# Altium project Arm.PrjPcb
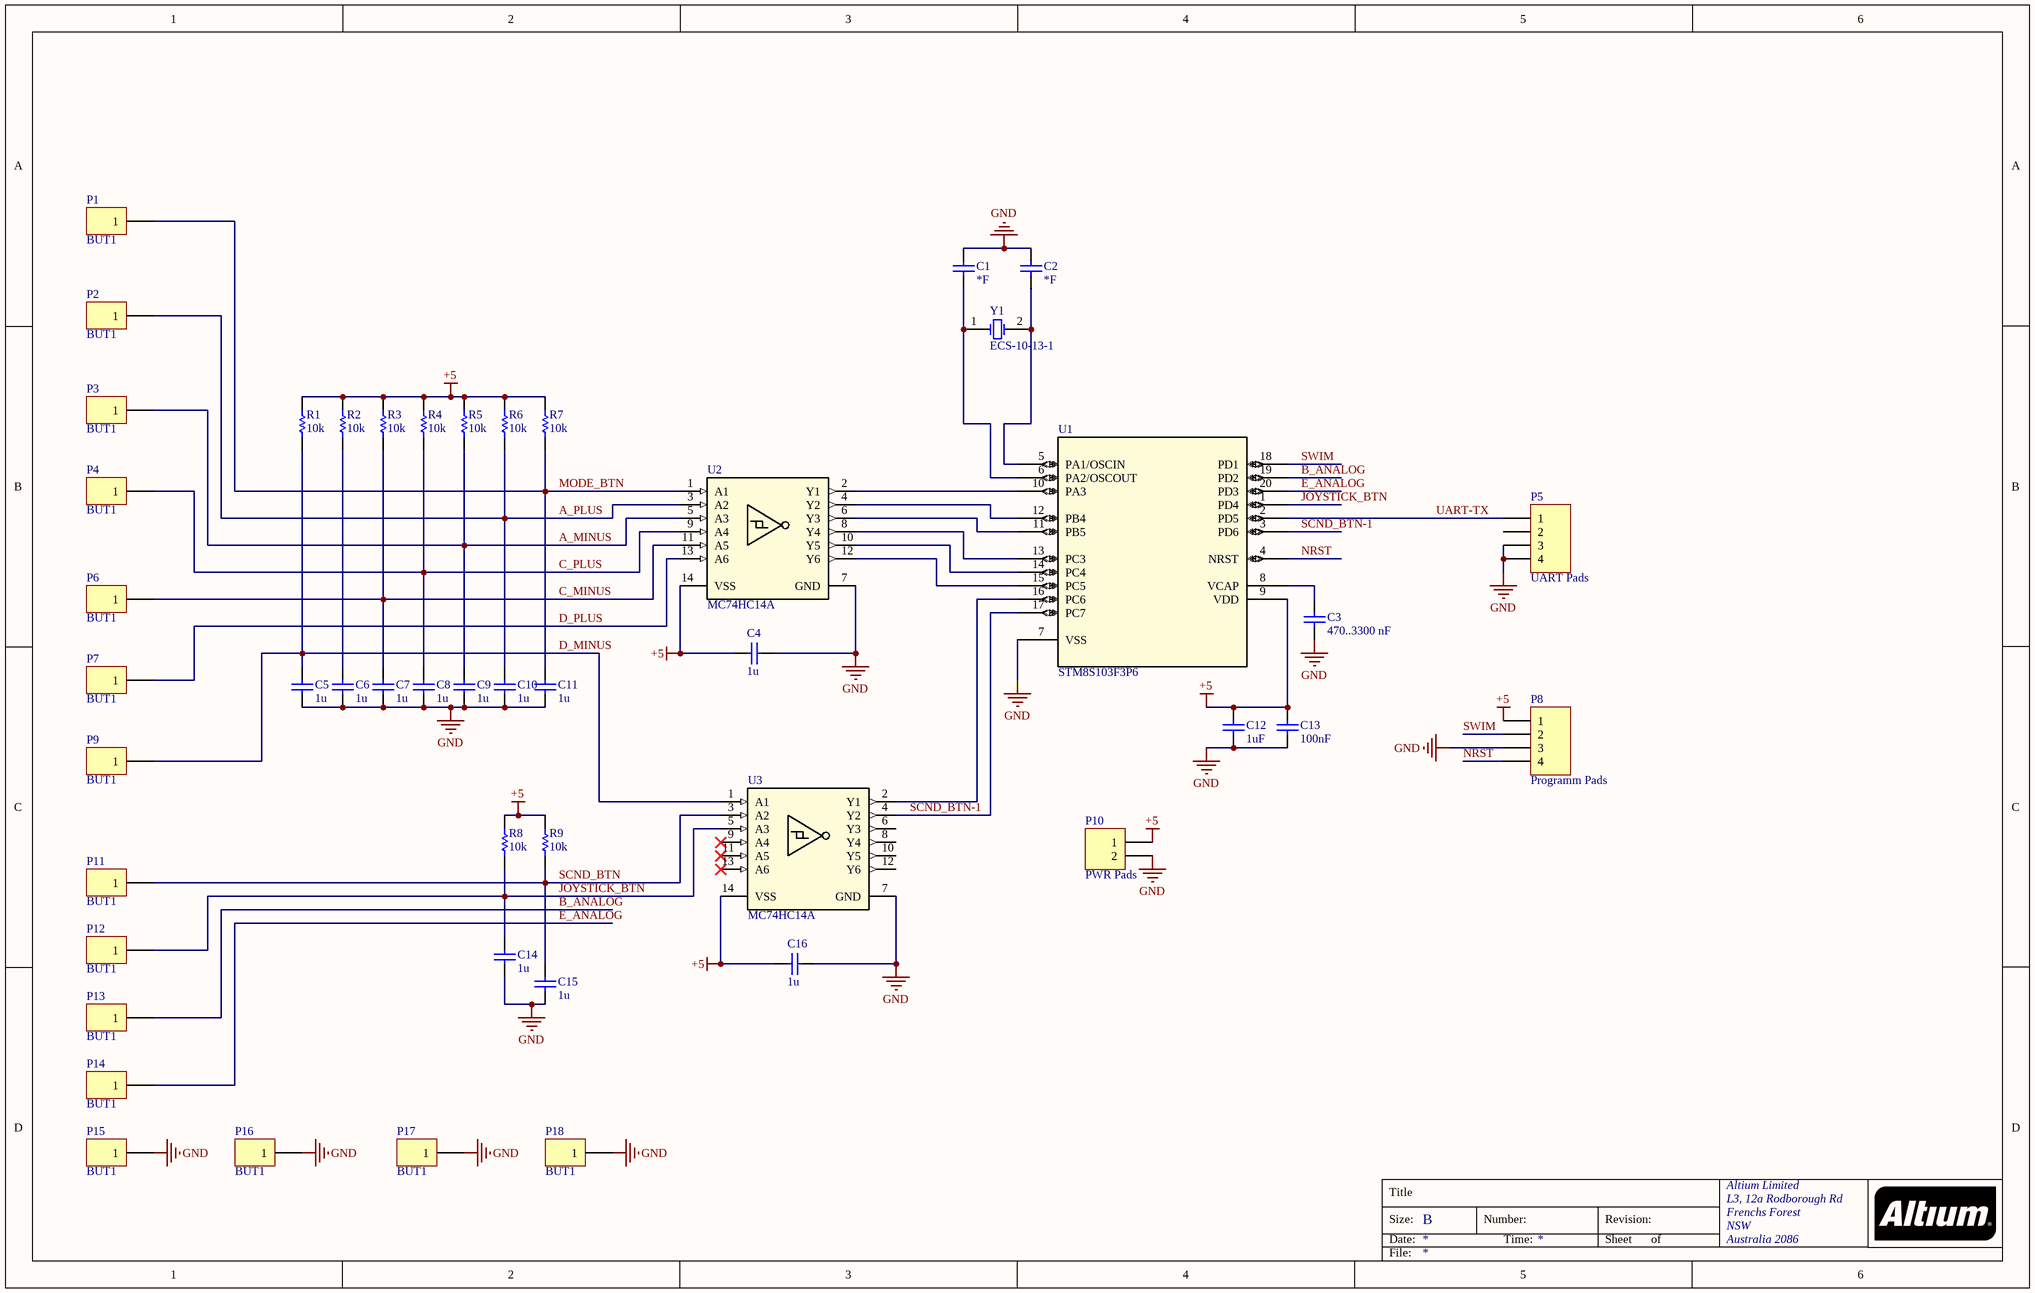
[diagram p0: Sheme.SchDoc]
1 sheet, 47 parts. Net scope: global (net labels, ports and power ports of the same name join across sheets).
Board file: PCB.PcbDoc

## Sheet Sheme.SchDoc
size B; Organization: Altium Limited; Address1: L3, 12a Rodborough Rd; Address2: Frenchs Forest; Address3: NSW; Address4: Australia 2086

### Parts
C1  value *F  [C0805]  (hidden comment: Cap)
C2  value *F  [C0805]  (hidden comment: Cap)
C3  value 470..3300 nF  [C0805]  (hidden comment: Cap)
C4  value 1u  [C0805]  (hidden comment: Cap)
C5  value 1u  [C0805]  (hidden comment: Cap)
C6  value 1u  [C0805]  (hidden comment: Cap)
C7  value 1u  [C0805]  (hidden comment: Cap)
C8  value 1u  [C0805]  (hidden comment: Cap)
C9  value 1u  [C0805]  (hidden comment: Cap)
C10  value 1u  [C0805]  (hidden comment: Cap)
C11  value 1u  [C0805]  (hidden comment: Cap)
C12  value 1uF  [C0805]  (hidden comment: Cap)
C13  value 100nF  [C0805]  (hidden comment: Cap)
C14  value 1u  [C0805]  (hidden comment: Cap)
C15  value 1u  [C0805]  (hidden comment: Cap)
C16  value 1u  [C0805]  (hidden comment: Cap)
P1  BUT1  [1pin-smd]
P2  BUT1  [1pin-smd]
P3  BUT1  [1pin-smd]
P4  BUT1  [1pin-smd]
P5  UART Pads  [HDR1X4]
P6  BUT1  [1pin-smd]
P7  BUT1  [1pin-smd]
P8  Programm Pads  [HDR1X4]
P9  BUT1  [1pin-smd]
P10  PWR Pads  [2pin-smd]
P11  BUT1  [1pin-smd]
P12  BUT1  [1pin-smd]
P13  BUT1  [1pin-smd]
P14  BUT1  [1pin-smd]
P15  BUT1  [1pin-smd]
P16  BUT1  [1pin-smd]
P17  BUT1  [1pin-smd]
P18  BUT1  [1pin-smd]
R1  10k  [RES-0805]
R2  10k  [RES-0805]
R3  10k  [RES-0805]
R4  10k  [RES-0805]
R5  10k  [RES-0805]
R6  10k  [RES-0805]
R7  10k  [RES-0805]
R8  10k  [RES-0805]
R9  10k  [RES-0805]
U1  STM8S103F3P6  [SSOP20]
U2  MC74HC14A  [SOIC-14_N]
U3  MC74HC14A  [SOIC-14_N]
Y1  ECS-10-13-1  [HC-49U]

### Nets
+5: C4.2 C12.2 C13.2 C16.2 P8.1 P10.1 R1.2 R2.2 R3.2 R4.2 R5.2 R6.2 R7.2 R8.2 R9.2 U1.9(VDD) U2.14(VSS) U3.14(VSS)
GND: C1.2 C2.2 C3.1 C4.1 C5.1 C6.1 C7.1 C8.1 C9.1 C10.1 C11.1 C12.1 C13.1 C14.1 C15.1 C16.1 P5.3 P5.4 P8.3 P10.2 P15.1 P16.1 P17.1 P18.1 U1.7(VSS) U2.7(GND) U3.7(GND)
A_MINUS: C9.2 P3.1 R5.1 U2.5(A3)
A_PLUS: C10.2 P2.1 R6.1 U2.3(A2)
B_ANALOG: P13.1 U1.19(PD2)
C_MINUS: C7.2 P6.1 R3.1 U2.11(A5)
C_PLUS: C8.2 P4.1 R4.1 U2.9(A4)
D_MINUS: C5.2 P9.1 R1.1 U3.1(A1)
D_PLUS: P7.1 U2.13(A6)
E_ANALOG: P14.1 U1.20(PD3)
JOYSTICK_BTN: C14.2 P12.1 R8.1 U1.1(PD4) U3.5(A3)
MODE_BTN: C11.2 P1.1 R7.1 U2.1(A1)
NRST: P8.4 U1.4(NRST)
SCND_BTN: C15.2 P11.1 R9.1 U3.3(A2)
SCND_BTN-1: U1.3(PD6) U1.17(PC7) U3.4(Y2)
SWIM: P8.2 U1.18(PD1)
UART-TX: P5.1 U1.2(PD5)
NetC1_1: C1.1 U1.6(PA2/OSCOUT) Y1.1(OSC1)
NetC2_1: C2.1 U1.5(PA1/OSCIN) Y1.2(OSC2)
NetC3_2: C3.2 U1.8(VCAP)
NetC6_2: C6.2 R2.1
NetU1_10: U1.10(PA3) U2.2(Y1)
NetU1_11: U1.11(PB5) U2.6(Y3)
NetU1_12: U1.12(PB4) U2.4(Y2)
NetU1_13: U1.13(PC3) U2.8(Y4)
NetU1_14: U1.14(PC4) U2.10(Y5)
NetU1_15: U1.15(PC5) U2.12(Y6)
NetU1_16: U1.16(PC6) U3.2(Y1)

Not connected (* = marked no-connect by the designer): P5 2; U3 6(Y3) 8(Y4) 9(A4)* 10(Y5) 11(A5)* 12(Y6) 13(A6)*

### Notes on the sheet
- Title
- Size:
- Date:
- B
- Number:
- Time:
- Revision:
- Sheet
- of
- File:

### Library data of the parts
C1-C16 = Cap: Capacitor ceramic SMD; Manufacturer: Murata; Part_Type: Capacitor
P1-P4 P6 P7 P9 P11-P18 = Header 1: Part_Type: Connector; Manufacturer_Part_Number: *; Manufacturer: *; CHIPIDIP-code: *
P5 P8 = Header 4: Header, 4-Pin; Manufacturer: Re-released for DXP Platform.; Value: Connector; Manufacturer_Part_Number: *; Part_Type: *
P10 = Header 2: Header, 2-Pin; Part_Type: Connector; Manufacturer_Part_Number: *; Manufacturer: *; CHIPIDIP-code: *
R1-R9 = Res: Rectangular Thick Film Chip Resistor; Manufacturer: Altium Limited; Note: If flow soldering, adjust pad width of PCB Footprint to 0.7 - 0.8 times the width of the resistor.; Manufacturer_Part_Number: 17-Dec-2003; Part_Type: Resistor; ComponentLink1Description: Manufacturer Link; ComponentLink1URL: http://www.panasonic.com/industrial/components/resistive_products.htm; ComponentLink2Description: Datasheet; ComponentLink2URL: http://www.panasonic.com/industrial/components/pdf/AOA0000CE8.pdf; Value: 10k
U1 = STM8S103F3P6: No Description Available; Mfr_Name: STMicroelectronics; Copyright: Copyright (C) 2022 Ultra Librarian. All rights reserved.; Manufacturer_Part_Number: STM8S103F3P6; RefDes: RefDes; Type: DEV; ComponentLink1Description: DataSheet; ComponentLink1URL: https://www.st.com/resource/en/datasheet/stm8s103f3.pdf
U2 U3 = MC74HC14A: Hex Schmitt-Trigger / Inverter; Mfr_Name: ON Semiconductor; Copyright: Copyright (C) 2022 Ultra Librarian. All rights reserved.; Manufacturer_Part_Number: MC74HC14A; RefDes: RefDes; Type: DEV; ComponentLink1Description: DataSheet; ComponentLink1URL: https://www.onsemi.com/pdf/datasheet/mc74hc14a-d.pdf
Y1 = ECS-10-13-1: Crystal Oscillator; Published: 17-Jul-2002; DatasheetDocument: 18-Apr-2000; PackageReference: HC-49U; Publisher: Altium Limited; ComponentLink1Description: Manufacturer Link; ComponentLink1URL: http://www.ecsxtal.com/; ComponentLink2Description: Datasheet; ComponentLink2URL: http://www.ecsxtal.com/pdf2/HC49U.PDF

## Assembly variants
DNP: not fitted C2 U1